# EasyEDA Pro project ProPrj_AD9363_Debug_2025-10-27.epro, board PCB1
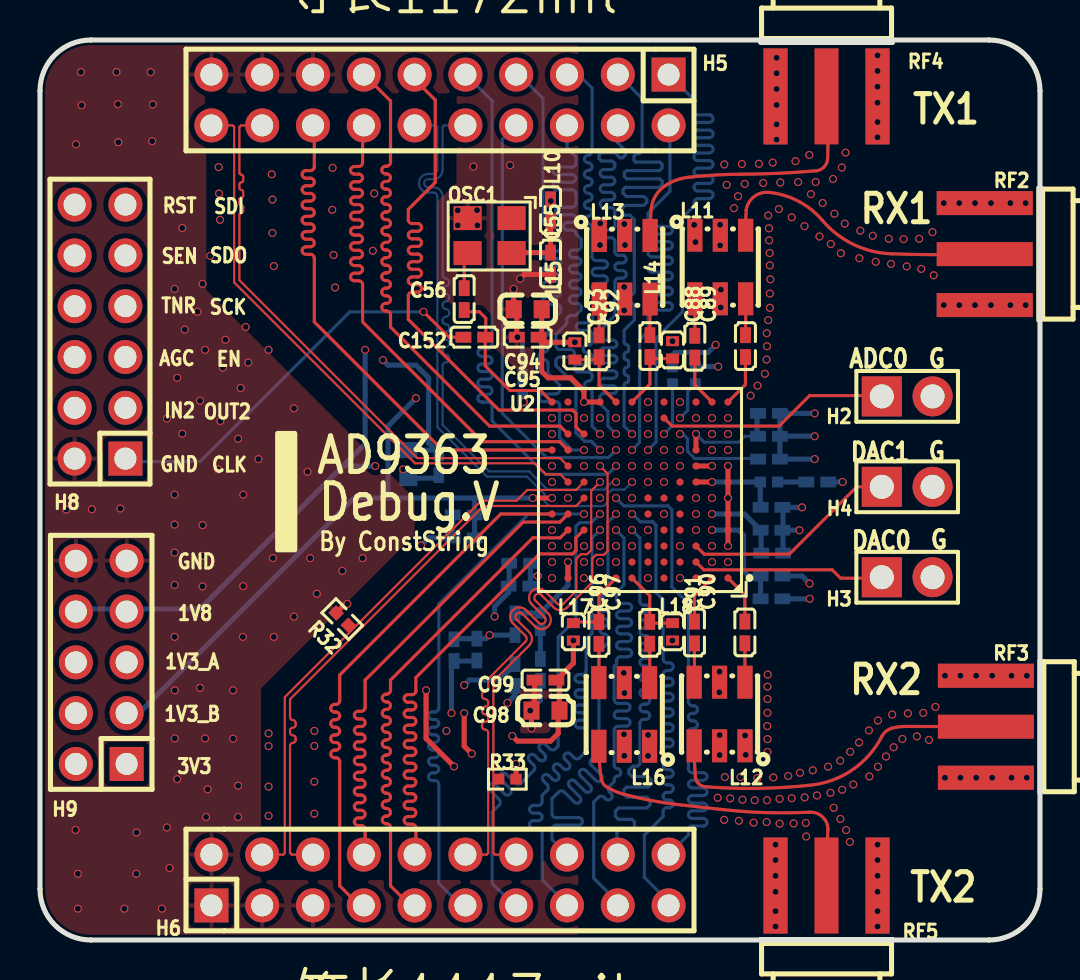
[diagram p3: board, top side]
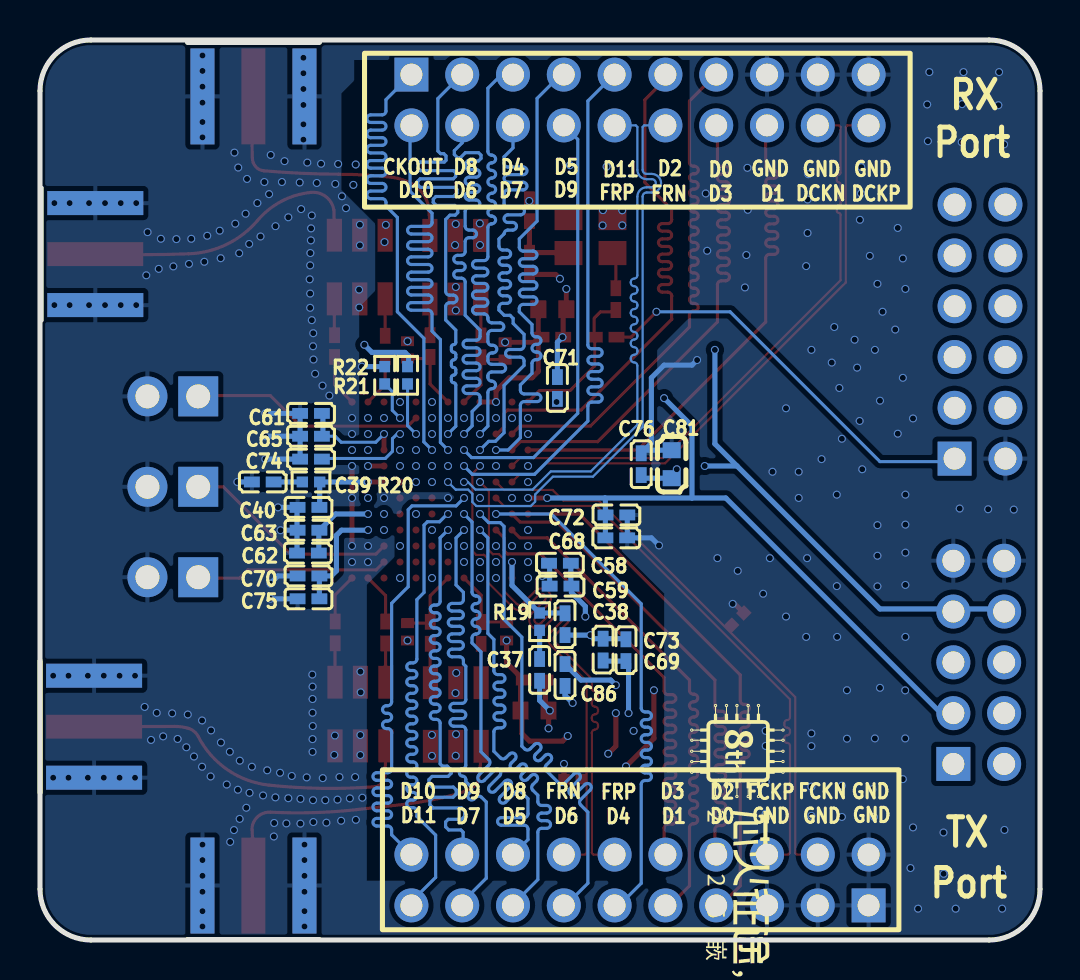
[diagram p4: board, bottom side, seen from below]

Outline 50 x 45 mm; copper layers: Top Layer, Inner1, Inner2, Bottom Layer. Coordinates in mm from the lower left corner of the outline.
Outline path: 0,42.46 0,2.54 arc(0.74,0.74) 2.54,0 47.46,0 arc(49.26,0.74) 50,2.54 50,42.46 arc(49.26,44.26) 47.46,45 2.54,45 arc(0.74,44.26) 0,42.46
Stack: Top Layer 0.035mm 外层铜厚1oz / Dielectric1 0.2104mm 7628 RC49% 8.6mil / Inner1 0.0152mm 内层铜厚 / Dielectric2 1.065mm 1.1mm H/HOZ Copper / Inner2 0.0152mm 内层铜厚 / Dielectric3 0.2104mm 7628 RC49% 8.6mil / Bottom Layer 0.035mm 外层铜厚1oz

## Design rules (mm)
net FB_CLK_N: DP3
net TX_FRAME_N: DP4
net RX_FRAME_N: DP2
net RX_FRAME_P: DP2
net TX_FRAME_P: DP4
net FB_CLK_P: DP3
net DATA_CLK_P: DP1
net DATA_CLK_N: DP1
template: 自定义配置
spacing copperThickness1oz (default): track to track 0.152, other pairs 0.102 to 0.3
spacing copperThickness2oz: track to track 0.203, other pairs 0.152 to 0.3
track width copperThickness1oz (default): min 0.127, default 0.254, max 2.54
track width copperThickness2oz: min 0.203, default 0.254, max 2.54
differential pair differentialPair (default): width min 0.102, default 0.109, max 2.54; gap min 0.152, default 0.152
via viaSize (default): diameter min 0.3, default 0.399, max 10; hole min 0.3, default 0.3, max 6.299

## Placement (name value [footprint] x y rotation side)
C37  1uF  [C0402]  25.02 13.5 90 bottom
C38  1nF  [C0402]  23.75 15.79 270 bottom
C39  1uF  [C0402]  38.86 22.9 180 bottom
C40  1nF  [C0402]  36.58 21.63 0 bottom
C55  100nF  [C0402]  25.53 33.82 270 top
C56  100nF  [C0402]  21.21 32.05 90 top
C58  1uF  [C0402]  24 18.84 0 bottom
C59  10nF  [C0402]  23.97 17.69 0 bottom
C61  1uF  [C0402]  36.45 26.33 180 bottom
C62  1uF  [C0402]  36.6 19.35 180 bottom
C63  10nF  [C0402]  36.58 20.49 180 bottom
C65  10nF  [C0402]  36.45 25.19 180 bottom
C68  1uF  [C0402]  21.19 20.11 0 bottom
C69  1uF  [C0402]  21.84 14.52 270 bottom
C70  1uF  [C0402]  36.58 18.2 180 bottom
C71  10nF  [C0402]  24.13 27.6 270 bottom
C72  10nF  [C0402]  21.18 21.25 0 bottom
C73  10nF  [C0402]  20.7 14.49 270 bottom
C74  10nF  [C0402]  36.45 24.05 180 bottom
C75  10nF  [C0402]  36.58 17.06 180 bottom
C76  10nF  [C0402]  19.94 23.79 270 bottom
C81  10uF  [C0603]  18.41 23.79 270 bottom
C86  1uF  [C0402]  23.75 13.25 270 bottom
C88  18pF  [C0402]  32.74 29.67 270 top
C89  18pF  [C0402]  35.27 29.7 270 top
C90  18pF  [C0402]  35.24 15.38 90 top
C91  18pF  [C0402]  32.72 15.38 90 top
C92  18pF  [C0402]  30.5 29.7 90 top
C93  18pF  [C0402]  27.95 29.69 90 top
C94  10uF  [C0603]  24.38 31.54 0 top
C95  1nF  [C0402]  24.38 30.14 0 top
C96  18pF  [C0402]  27.94 15.35 270 top
C97  18pF  [C0402]  30.49 15.36 270 top
C98  10uF  [C0603]  25.27 11.47 0 top
C99  1nF  [C0402]  25.27 13 0 top
C152  100nF  [C0402]  21.72 30.14 0 top
H2  PZ254V-11-02P  [HDR-TH_2P-P2.54-V-M]  43.36 27.18 0 top
H3  PZ254V-11-02P  [HDR-TH_2P-P2.54-V-M]  43.36 18.14 0 top
H4  PZ254V-11-02P  [HDR-TH_2P-P2.54-V-M]  43.36 22.66 0 top
H5  PZ254V-12-20P  [HDR-TH_20P-P2.54-V-M-R2-C10-S2.54]  20 42 180 top
H6  PZ254V-12-20P  [HDR-TH_20P-P2.54-V-M-R2-C10-S2.54]  20 3 0 top
H8  PZ254V-12-12P  [HDR-TH_12P-P2.54-V-M-R2-C6-S2.54]  3 30.42 90 top
H9  PZ254V-12-10P  [HDR-TH_10P-P2.54-V-M-R2-C5-S2.54]  3.06 13.88 90 top
L10  BLM15PD121SN1D  [L0402]  25.53 36.49 90 top
L11  TCM1-63AX+  [XFMR-SMD_TCM1-63AX]  34.01 33.65 0 top
L12  TCM1-63AX+  [XFMR-SMD_TCM1-63AX]  33.98 11.3 180 top
L13  TCM1-63AX+  [XFMR-SMD_TCM1-63AX]  29.23 33.64 0 top
L14  330nH  [IND-SMD_L1.0-W0.6]  31.62 29.51 270 top
L15  330nH  [IND-SMD_L1.0-W0.6]  26.74 29.45 270 top
L16  TCM1-63AX+  [XFMR-SMD_TCM1-63AX]  29.21 11.28 180 top
L17  330nH  [IND-SMD_L1.0-W0.6]  26.67 15.41 90 top
L18  330nH  [IND-SMD_L1.0-W0.6]  31.62 15.41 90 top
OSC1  40MHz  [OSC-SMD_4P-L3.2-W2.5-BL]  22.48 35.22 180 top
R19  1Ω  [R0402]  25.02 15.92 90 bottom
R20  1Ω  [R0402]  36.45 22.9 180 bottom
R21  10kΩ  [R0402]  31.62 28.24 90 bottom
R22  14.3kΩ  [R0402]  32.77 28.24 90 bottom
R32  NC  [R0402]  15.11 16.04 135 top
R33  NC  [R0402]  23.37 8.04 0 top
RF2  -  [SMA-SMD_BWSMA-KE-P001]  47.24 34.3 0 top
RF3  -  [SMA-SMD_BWSMA-KE-P001]  47.3 10.66 0 top
RF4  -  [SMA-SMD_BWSMA-KE-P001]  39.33 42.18 90 top
RF5  -  [SMA-SMD_BWSMA-KE-P001]  39.33 2.72 270 top
U2  AD9363ABCZ  [CSPBGA-144_L10.0-W10.0-R12-C12-P0.80-TL]  30 22.5 180 top

## Footprints (pads in the part's own frame, mm; a bottom-side part is the same pattern mirrored in y, then rotated)
C0402
  rect 0.79x0.54 smd: 1(-0.545,0) 2(0.545,0)
C0603
  rect 0.8x0.9 smd: 1(-0.7,0) 2(0.7,0)
CSPBGA-144_L10.0-W10.0-R12-C12-P0.80-TL
  round 0.36 smd: A1(-4.4,4.4) A2(-3.6,4.4) A3(-2.8,4.4) A4(-2,4.4) A5(-1.2,4.4) A6(-0.4,4.4) A7(0.4,4.4) A8(1.2,4.4) A9(2,4.4) A10(2.8,4.4) A11(3.6,4.4) A12(4.4,4.4) B1(-4.4,3.6) B2(-3.6,3.6) B3(-2.8,3.6) B4(-2,3.6) B5(-1.2,3.6) B6(-0.4,3.6) B7(0.4,3.6) B8(1.2,3.6) B9(2,3.6) B10(2.8,3.6) B11(3.6,3.6) B12(4.4,3.6) C1(-4.4,2.8) C2(-3.6,2.8) C3(-2.8,2.8) C4(-2,2.8) C5(-1.2,2.8) C6(-0.4,2.8) C7(0.4,2.8) C8(1.2,2.8) C9(2,2.8) C10(2.8,2.8) C11(3.6,2.8) C12(4.4,2.8) D1(-4.4,2) D2(-3.6,2) D3(-2.8,2) D4(-2,2) D5(-1.2,2) D6(-0.4,2) D7(0.4,2) D8(1.2,2) D9(2,2) D10(2.8,2) D11(3.6,2) D12(4.4,2) E1(-4.4,1.2) E2(-3.6,1.2) E3(-2.8,1.2) E4(-2,1.2) E5(-1.2,1.2) E6(-0.4,1.2) E7(0.4,1.2) E8(1.2,1.2) E9(2,1.2) E10(2.8,1.2) E11(3.6,1.2) E12(4.4,1.2) F1(-4.4,0.4) F2(-3.6,0.4) F3(-2.8,0.4) F4(-2,0.4) F5(-1.2,0.4) F6(-0.4,0.4) F7(0.4,0.4) F8(1.2,0.4) F9(2,0.4) F10(2.8,0.4) F11(3.6,0.4) F12(4.4,0.4) G1(-4.4,-0.4) G2(-3.6,-0.4) G3(-2.8,-0.4) G4(-2,-0.4) G5(-1.2,-0.4) G6(-0.4,-0.4) G7(0.4,-0.4) G8(1.2,-0.4) G9(2,-0.4) G10(2.8,-0.4) G11(3.6,-0.4) G12(4.4,-0.4) H1(-4.4,-1.2) H2(-3.6,-1.2) H3(-2.8,-1.2) H4(-2,-1.2) H5(-1.2,-1.2) H6(-0.4,-1.2) H7(0.4,-1.2) H8(1.2,-1.2) H9(2,-1.2) H10(2.8,-1.2) H11(3.6,-1.2) H12(4.4,-1.2) J1(-4.4,-2) J2(-3.6,-2) J3(-2.8,-2) J4(-2,-2) J5(-1.2,-2) J6(-0.4,-2) J7(0.4,-2) J8(1.2,-2) J9(2,-2) J10(2.8,-2) J11(3.6,-2) J12(4.4,-2) K1(-4.4,-2.8) K2(-3.6,-2.8) K3(-2.8,-2.8) K4(-2,-2.8) K5(-1.2,-2.8) K6(-0.4,-2.8) K7(0.4,-2.8) K8(1.2,-2.8) K9(2,-2.8) K10(2.8,-2.8) K11(3.6,-2.8) K12(4.4,-2.8) L1(-4.4,-3.6) L2(-3.6,-3.6) L3(-2.8,-3.6) L4(-2,-3.6) L5(-1.2,-3.6) L6(-0.4,-3.6) L7(0.4,-3.6) L8(1.2,-3.6) L9(2,-3.6) L10(2.8,-3.6) L11(3.6,-3.6) L12(4.4,-3.6) M1(-4.4,-4.4) M2(-3.6,-4.4) M3(-2.8,-4.4) M4(-2,-4.4) M5(-1.2,-4.4) M6(-0.4,-4.4) M7(0.4,-4.4) M8(1.2,-4.4) M9(2,-4.4) M10(2.8,-4.4) M11(3.6,-4.4) M12(4.4,-4.4)
HDR-TH_2P-P2.54-V-M
  rect 2x2 hole 1.2: 1(-1.27,0)
  round 2 hole 1.2: 2(1.27,0)
HDR-TH_10P-P2.54-V-M-R2-C5-S2.54
  rect 1.7x1.7 hole 1.1: 1(-5.08,-1.27)
  round 1.7 hole 1.1: 2(-5.08,1.27) 3(-2.54,-1.27) 4(-2.54,1.27) 5(0,-1.27) 6(0,1.27) 7(2.54,-1.27) 8(2.54,1.27) 9(5.08,-1.27) 10(5.08,1.27)
HDR-TH_12P-P2.54-V-M-R2-C6-S2.54
  rect 1.7x1.7 hole 1.1: 1(-6.35,-1.27)
  round 1.7 hole 1.1: 2(-6.35,1.27) 3(-3.81,-1.27) 4(-3.81,1.27) 5(-1.27,-1.27) 6(-1.27,1.27) 7(1.27,-1.27) 8(1.27,1.27) 9(3.81,-1.27) 10(3.81,1.27) 11(6.35,-1.27) 12(6.35,1.27)
HDR-TH_20P-P2.54-V-M-R2-C10-S2.54
  rect 1.7x1.7 hole 1.1: 1(-11.43,-1.27)
  round 1.7 hole 1.1: 2(-11.43,1.27) 3(-8.89,-1.27) 4(-8.89,1.27) 5(-6.35,-1.27) 6(-6.35,1.27) 7(-3.81,-1.27) 8(-3.81,1.27) 9(-1.27,-1.27) 10(-1.27,1.27) 11(1.27,-1.27) 12(1.27,1.27) 13(3.81,-1.27) 14(3.81,1.27) 15(6.35,-1.27) 16(6.35,1.27) 17(8.89,-1.27) 18(8.89,1.27) 19(11.43,-1.27) 20(11.43,1.27)
IND-SMD_L1.0-W0.6
  rect 0.5x0.648 smd: 1(-0.434,0) 2(0.434,0)
L0402
  rect 0.79x0.54 smd: 1(-0.545,0) 2(0.545,0)
OSC-SMD_4P-L3.2-W2.5-BL
  rect 1.4x1.2 smd: 1(-1.1,-0.875) 2(1.1,-0.875) 3(1.1,0.875) 4(-1.1,0.875)
R0402
  rect 0.566x0.54 smd: 1(-0.433,0) 2(0.433,0)
SMA-SMD_BWSMA-KE-P001
  rect 4.8x1.2 smd: 1(0,-2.55) 2(0,2.55) 5(0,0)
  rect 4.8x1.2 smd far side: 3(0,2.55) 4(0,-2.55)
XFMR-SMD_TCM1-63AX
  rect 0.76x1.65 smd: 1(-1.27,1.59) 2(0,1.59) 3(1.27,1.59) 4(1.27,-1.59) 5(0,-1.59) 6(-1.27,-1.59)

## Nets
As in the schematic.

Pads without a net: OSC1 1; U2 A3 A5 M3 M5 M11

## Via types
v1: diameter 0.399, hole 0.299, Top Layer to Bottom Layer, 420 vias

## Routing (per net, layer and track width the routed paths; a pad name or vN(x,y) marks a point on that pad's centre or on a via; arc(x,y) is an arc through that point)
1V3_A: length 78.8
  Top Layer w0.254: U2.J3 v1(32.8,25.3) ; v1(20.7,8.68) 19.3,10.08 v1(19.3,12.49)
  Inner2 w0.254: 19.26,13.89 H9.5 1.79,13.89 H9.6 ; 19.26,13.89 19.3,13.84 v1(19.3,12.49) ; 19.26,13.89 22.19,13.89 25.55,17.25 ; v1(32.8,25.3) 33.15,24.95 33.15,22.52 33.57,22.1 v1(33.6,22.1) v1(33.6,21.3) 35.26,21.3 36.83,19.73 36.83,14.9 35.94,14.01 27.81,14.01 26.54,12.74 26.54,10.96 24.89,9.31 22.61,9.31 21.97,8.68 v1(20.7,8.68) ; 25.55,17.25 v1(27.2,18.9) v1(28,18.9) ; 25.55,17.25 24.89,17.91 v1(24.89,18.2)
  Bottom Layer w0.152: C65.2 35.24,25.19 34.94,24.89 33.21,24.89 v1(32.8,25.3)
  Bottom Layer w0.254: 24.52,17.69 24.52,18.26 ; 24.52,18.26 24.52,18.81 C58.2 ; 24.52,18.26 24.58,18.2 v1(24.89,18.2) ; C62.2 36.06,20.46 C63.2 35.22,21.3 v1(33.6,21.3) ; 35.85,26.16 35.85,25.19
1V3_B: length 145.3
  Top Layer w0.254: v1(21.59,9.31) 21.21,9.69 v1(21.21,11.34) ; U2.M9 v1(27.2,26.9) 27.2,27.45 26.54,28.11 25.4,28.11 25.08,28.42 25.08,29.99 ; 25.08,29.99 C95.2 ; 25.08,29.99 C94.2 ; 25.08,29.99 25.18,29.89 v1(26.74,29.89) ; v1(25.6,22.1) v1(24.64,22.1) ; v1(23.61,10.2) 23.87,9.95 25.53,9.95 25.91,10.33 25.91,11.41 C98.2 25.97,12.84 C99.2 26.67,13.85 v1(26.67,14.97)
  Inner2 w0.254: 1.79,11.34 1.79,11.34 v1(20.57,11.34) v1(21.21,11.34) 27.2,17.34 v1(27.2,18.1) v1(28,18.1) ; 23.61,9.95 22.22,9.95 v1(21.59,9.31) ; 23.61,9.95 v1(23.61,10.2) ; 23.61,9.95 24.64,9.95 25.91,11.22 25.91,12.87 27.56,14.52 35.69,14.52 36.19,15.03 36.19,19.22 34.91,20.5 v1(33.6,20.5) v1(32.8,20.5) v1(32.8,21.3) 32,22.1 32,22.52 32.64,23.16 32.64,24.66 v1(32,25.3) ; v1(26.74,29.89) 31.57,29.89 v1(31.62,29.94) ; v1(18.8,27.09) 18.99,26.9 v1(24.17,26.9) v1(27.2,26.9) ; v1(26.67,14.97) v1(31.62,14.97)
  Bottom Layer w0.152: C74.2 35.87,24.08 32.73,24.08 32.38,24.43 32.38,25.07 32.15,25.3 v1(32,25.3)
  Bottom Layer w0.254: v1(20.57,11.34) 20.57,13.82 C73.2 21.81,13.95 C69.2 ; 4.95,11.34 15.71,22.1 17.4,22.1 ; 21.75,22.1 21.73,22.08 C68.2 ; 21.75,22.1 17.4,22.1 ; 21.75,22.1 v1(24.64,22.1) ; 17.4,22.1 17.4,25.7 v1(18.8,27.09) ; v1(33.6,20.5) 33.61,20.49 34.93,20.49 35.18,20.23 35.18,18.46 35.43,18.2 C70.2 C75.2
1V8: length 63.7
  Inner2 w0.254: 25.52,29 25.54,29.02 v1(25.54,36.95) ; 25.52,29 33.02,29 v1(33.78,29.76) ; 25.52,29 23.5,29 22.99,29.51 v1(16.26,29.51) ; v1(16.76,23.7) v1(25.6,23.7)
  Bottom Layer w0.254: 15.15,23.7 8,16.55 1.92,16.55 H9.8 ; 15.15,23.7 16.26,24.81 v1(16.26,29.51) ; 15.15,23.7 v1(16.76,23.7) ; 31.62,28.67 31.57,28.72 31.57,29.2 31.75,29.38 33.4,29.38 v1(33.78,29.76) ; C81.2 19.78,23.09 C76.2
  vias: v1(18.16,23.54)
3V3: length 33.2
  Inner2 w0.254: 23.11,12.11 23.11,12.11 v1(23.37,11.85) ; 23.11,12.11 28.8,17.8 v1(28.8,18.9) ; 23.11,12.11 19.8,8.81 H9.1 1.79,8.81 H9.2
  Bottom Layer w0.254: C86.2 23.75,12.23 v1(23.37,11.85)
GND: length 53.1
  Top Layer w0.254: C99.1 24.73,11.63 C98.1 v1(24.57,10.58) ; R33.2 v1(23.8,8.81) ; v1(34.4,19.7) U2.D1 U2.E1 v1(34.4,22.1) U2.G1 v1(34.4,23.7) ; v1(15.37,16.81) 15.26,16.81 14.81,16.35 ; U2.H3 v1(33.6,23.7) ; v1(23.88,30.14) C95.1 23.84,31.38 C94.1 v1(23.68,32.55) ; v1(24,33.06) 24.22,33.28 C55.2
  Bottom Layer w0.254: v1(17.15,29) 17.4,28.74 18.8,28.74 19.43,28.11 19.43,24.84 19.78,24.49 ; C65.1 v1(38.74,25.19) ; C65.1 C61.1 v1(38.74,26.33) ; C65.1 C74.1 v1(38.74,24.05) ; C75.1 v1(38.48,17.06) ; v1(19.05,19.73) 19.43,20.11 C68.1 20.63,20.11 C72.1 ; 19.78,24.49 C76.1 ; 19.78,24.49 C81.1 ; 37.15,20.49 v1(37.97,20.49) ; 37.15,20.49 37.15,21.6 C40.2 v1(38.1,21.63) ; 37.15,20.49 C63.1 ; 37.15,20.49 C62.1 ; v1(24.51,11.47) 25.02,11.98 C37.1 ; v1(23.88,30.14) 24.13,29.89 C71.1 ; v1(38.48,17.82) 38.1,18.2 C70.1 ; C38.2 v1(22.48,15.25) 22.3,15.06 C69.1 20.73,15.06 C73.1 ; 39.41,22.9 v1(40.13,22.9) ; C58.1 23.46,17.72 C59.1 23.43,17.38 22.73,16.68 v1(22.73,16.17) ; C86.1 22.95,13 21.46,13 v1(21.21,12.74) ; 32.77,28.67 v1(33.91,28.67)
  vias: v1(1.31,21.52) v1(1.8,39.78) v1(1.78,5.5) v1(1.89,3.31) v1(1.89,1.57) v1(2.05,43.4) v1(2.08,41.74) v1(2.59,21.54) v1(3.83,43.4) v1(3.9,41.79) v1(3.91,39.89) v1(4.02,21.57) v1(4.22,1.57) v1(4.83,5.38) v1(4.82,3.31) v1(5.53,43.4) v1(5.64,41.78) v1(5.61,39.94) v1(6.1,1.57) v1(6.35,26.08) v1(6.35,5.63) v1(6.48,3.6) v1(6.73,32.55) v1(6.73,22.27) v1(6.73,20.77) v1(6.73,19.37) v1(6.73,17.75) v1(6.73,15.16) v1(6.74,12.48) v1(6.74,10.08) v1(6.86,34.08) v1(6.86,28.11) v1(6.86,8.04) v1(7.11,35.6) v1(7.11,25.31) v1(7.24,30.52) v1(7.87,31.41) v1(8,26.97) v1(8,12.61) v1(8.13,32.81) v1(8.13,20.74) v1(8.13,19.21) v1(8.13,17.68) v1(8.25,29.51) v1(8.25,10.08) v1(8.3,6.15) v1(8.38,7.53) v1(8.51,34.2) v1(8.93,38.64) v1(8.89,23.54) v1(8.95,37.33) v1(9,36.01) v1(9.02,25.95) v1(9.14,28.62) v1(9.27,30.01) v1(9.65,12.49) v1(9.65,10.06) v1(9.91,25.06) v1(9.91,7.72) v1(9.91,6.15) v1(10.03,27.6) v1(10.14,15.16) v1(10.16,22.27) v1(10.16,17.69) v1(10.29,30.65) v1(10.41,28.87) v1(10.92,24.05) v1(11.43,29.51) v1(11.43,10.33) v1(11.43,9.69) v1(11.43,7.67) v1(11.43,6.21) v1(11.59,38.29) v1(11.62,37.02) v1(11.62,35.35) v1(11.64,19.09) v1(11.69,33.7) v1(11.69,15.16) v1(12.06,23.41) v1(12.06,22.1) v1(12.7,26.58) v1(12.7,16.17) v1(13.38,23.41) v1(13.51,19.09) v1(13.72,10.46) v1(13.72,9.7) v1(13.72,7.92) v1(13.72,6.32) v1(13.84,17.31) v1(14.63,38.61) v1(14.61,36.51) v1(14.68,34.25) v1(14.75,32.63) v1(15.11,18.46) v1(16.13,19.09) v1(16.64,34.46) v1(16.71,37.33) v1(20.32,10.46) v1(20.89,36.48) v1(20.89,35.73) v1(21.67,38.67) v1(21.85,36.49) v1(21.87,35.73) v1(23.5,38.74) v1(25.6,26.1) v1(25.6,25.3) v1(25.6,22.9) v1(25.6,20.5) v1(25.6,19.7) v1(25.6,18.9) v1(25.6,18.1) v1(26.4,26.1) v1(26.4,22.1) v1(26.4,19.7) v1(27.2,26.1) v1(27.2,23.7) v1(27.2,19.7) v1(28.01,35.83) v1(28,34.75) v1(28,26.1) v1(28,22.1) v1(28,19.7) v1(28.8,26.1) v1(28.8,19.7) v1(29.22,35.8) v1(29.25,34.75) v1(29.21,32.65) v1(29.21,31.48) v1(29.19,13.35) v1(29.22,12.35) v1(29.2,10.29) v1(29.22,9.21) v1(29.6,26.1) v1(29.6,23.7) v1(29.6,22.1) v1(29.6,19.7) v1(30.4,26.9) v1(30.4,23.7) v1(30.4,18.1) v1(30.4,10.25) v1(30.4,9.21) v1(31.2,23.7) v1(32,26.9) v1(32,19.7) v1(32,18.1) v1(32.71,35.76) v1(32.77,34.9) v1(32.8,26.1) v1(32.8,22.1) v1(33.6,26.1) v1(33.6,25.3) v1(33.6,24.5) v1(33.6,19.7) v1(33.6,18.9) v1(33.88,7.11) v1(34,35.76) v1(34,34.73) v1(34.05,32.52) v1(34.04,31.63) v1(33.98,13.42) v1(33.97,12.38) v1(33.98,10.25) v1(33.98,9.25) v1(34.21,38.78) v1(34.24,8.15) v1(34.21,6.01) v1(34.33,37.76) v1(34.4,26.1) v1(34.4,25.3) v1(34.4,24.5) v1(34.4,18.9) v1(34.51,7.08) v1(34.7,36.59) v1(34.9,37.19) v1(34.94,5.96) v1(35.03,8.15) v1(35.09,38.8) v1(35.12,7.02) v1(35.24,37.8) v1(35.25,10.22) v1(35.29,9.26) v1(35.53,27.22) v1(35.74,6.99) v1(35.68,5.87) v1(35.95,38.81) v1(35.88,27.72) v1(35.86,8.09) v1(36.16,37.85) v1(36.24,28.31) v1(36.34,30.34) v1(36.33,29.02) v1(36.33,5.9) v1(36.41,36.23) v1(36.45,35.58) v1(36.41,30.99) v1(36.35,29.69) v1(36.39,13.27) v1(36.37,12.67) v1(36.37,12.05) v1(36.37,11.36) v1(36.36,10.7) v1(36.37,10.04) v1(36.37,9.4) v1(36.35,6.99) v1(36.46,34.98) v1(36.48,34.35) v1(36.49,33.73) v1(36.52,33.03) v1(36.49,32.32) v1(36.49,31.61) v1(36.64,38.87) v1(36.66,8.13) v1(36.83,44.11) v1(36.83,43.34) v1(36.83,42.55) v1(36.83,41.75) v1(36.83,40.78) v1(36.83,40.02) v1(36.78,4.77) v1(36.78,4) v1(36.78,3.21) v1(36.78,2.41) v1(36.78,1.44) v1(36.78,0.68) v1(36.94,36.55) v1(37.01,37.88) v1(36.98,7.05) v1(36.98,5.82) v1(37.41,8.2) v1(37.58,36.14) v1(37.58,7.09) v1(37.68,5.83) v1(37.77,38.94) v1(37.91,37.9) v1(38,8.36) v1(38.23,35.69) v1(38.23,7.13) v1(38.29,5.85) v1(38.31,5.17) v1(38.46,39.25) v1(38.55,37.29) v1(38.64,8.49) v1(38.78,37.9) v1(38.85,7.23) v1(38.97,35.17) v1(39.13,36.85) v1(39.41,8.66) v1(39.54,34.8) v1(39.52,7.36) v1(39.65,38.05) v1(39.72,36.31) v1(39.69,6.61) v1(40.04,34.34) v1(40.01,8.97) v1(40.02,6.05) v1(40.09,38.62) v1(40.11,7.51) v1(40.24,35.82) v1(40.28,39.37) v1(40.3,5.5) v1(40.51,9.41) v1(40.49,4.9) v1(40.66,7.77) v1(41.01,35.46) v1(40.97,34.09) v1(40.95,9.87) v1(41.45,10.48) v1(41.47,8.18) v1(41.64,35.21) v1(41.78,33.91) v1(41.88,44.23) v1(41.88,43.45) v1(41.88,42.67) v1(41.88,41.87) v1(41.88,40.9) v1(41.88,40.13) v1(41.9,10.98) v1(41.9,8.66) v1(41.88,4.77) v1(41.88,4) v1(41.88,3.21) v1(41.88,2.41) v1(41.88,1.44) v1(41.88,0.68) v1(42.3,9.17) v1(42.44,35.06) v1(42.55,33.8) v1(42.61,11.27) v1(42.68,9.64) v1(43.12,10.05) v1(43.18,35.04) v1(43.33,33.68) v1(43.39,11.33) v1(43.84,10.18) v1(43.96,35.06) v1(44.06,33.56) v1(44.16,11.36) v1(44.45,10) v1(44.62,35.39) v1(44.69,33.23) v1(44.77,11.65) v1(45.19,36.85) v1(45.19,31.75) v1(45.25,13.21) v1(45.25,8.11) v1(45.96,36.85) v1(45.96,31.75) v1(46.02,13.21) v1(46.02,8.11) v1(46.75,36.85) v1(46.75,31.75) v1(46.81,13.21) v1(46.81,8.11) v1(47.55,36.85) v1(47.55,31.75) v1(47.61,13.21) v1(47.61,8.11) v1(48.52,36.85) v1(48.52,31.75) v1(48.58,13.21) v1(48.58,8.11) v1(49.28,36.85) v1(49.28,31.75) v1(49.34,13.21) v1(49.34,8.11)
AUX_ADC: length 11.7
  Top Layer w0.152: U2.L5 31.6,25.7 36.96,25.7 38.48,27.22 42.05,27.22 H2.1
AUX_DAC1: length 9.6
  Top Layer w0.152: H3.1 42.04,18.09 40.03,18.09 39.61,18.51 33.19,18.51 U2.B3
AUX_DAC2: length 10.9
  Top Layer w0.152: H4.1 40.84,22.66 37.47,19.29 33.21,19.29 U2.C3
CLK_OUT: length 29.8
  Bottom Layer w0.158: H5.1 31.45,43.27 32.7,42.02 32.7,41.45 arc(32.76,41.31) 32.89,41.26 33.46,41.26 arc(33.66,41.07) 33.46,40.88 32.89,40.88 arc(32.7,40.69) 32.89,40.5 33.46,40.5 arc(33.66,40.31) 33.46,40.11 32.89,40.11 arc(32.7,39.92) 32.89,39.73 33.46,39.73 arc(33.66,39.54) 33.46,39.35 32.89,39.35 arc(32.7,39.16) 32.89,38.97 33.46,38.97 arc(33.66,38.78) 33.46,38.59 32.89,38.59 arc(32.7,38.4) 32.89,38.21 33.46,38.21 arc(33.66,38.02) 33.46,37.83 32.89,37.83 arc(32.7,37.64) 32.89,37.45 33.46,37.45 arc(33.66,37.26) 33.46,37.07 32.89,37.07 arc(32.76,37.01) 32.7,36.88 32.7,36.7 32.13,36.13 32.13,31.41 30.81,30.09 30.81,24.91 v1(30.4,24.5)
CTRL_IN2: length 31.8
  Inner2 w0.158: H8.4 1.73,26.59 3.01,25.31 5.5,25.31 10.56,20.25 20.84,20.25 20.96,20.36 20.96,20.38 21.47,20.9 30,20.9 v1(30.4,20.5)
CTRL_OUT2: length 29.8
  Inner2 w0.158: v1(31.2,21.3) 30.8,21.7 20.51,21.7 19.69,20.87 10.87,20.87 5.14,26.61 H8.3
DATA_CLK_N: length 29.8
  Top Layer w0.109: H5.18 10.05,40.73 9.97,40.65 9.97,38.36 arc(10,38.29) 10.07,38.26 arc(10.13,38.24) 10.16,38.17 10.16,37.98 arc(10.13,37.91) 10.07,37.88 arc(10,37.85) 9.97,37.79 9.97,37.6 arc(10,37.53) 10.07,37.5 arc(10.13,37.47) 10.16,37.41 10.16,37.22 arc(10.13,37.15) 10.07,37.12 arc(10,37.09) 9.97,37.03 9.97,36.83 arc(10,36.77) 10.07,36.74 arc(10.13,36.71) 10.16,36.64 10.16,36.45 arc(10.13,36.39) 10.07,36.36 arc(10,36.33) 9.97,36.26 9.97,32.99 18.86,24.1 26,24.1 U2.H11
DATA_CLK_P: length 29.8
  Top Layer w0.109: U2.G11 26.02,23.28 25.29,23.28 24.74,23.83 18.75,23.83 9.71,32.88 9.71,40.65 9.63,40.73 H5.20
EN_AGC: length 33.1
  Inner2 w0.158: H8.6 1.75,29.15 3.05,27.86 5.21,27.86 11.43,21.63 18.8,21.63 19.69,22.52 30.82,22.52 v1(31.2,22.9)
ENABLE: length 29.3
  Inner2 w0.158: v1(30.4,22.9) 30.02,23.28 18.76,23.28 18,22.52 11.68,22.52 5.06,29.15 H8.5
EX_CLK: length 20.6
  Top Layer w0.152: v1(19.18,31.41) 20.45,30.14 C152.1
  Bottom Layer w0.152: v1(19.18,31.41) 15.49,31.41 8,23.92 4.42,23.92 H8.1
FB_CLK_N: length 28.4
  Top Layer w0.109: H6.4 12.16,4.27 12.24,4.35 12.24,12.14 22.06,21.96 23.83,21.96 24.37,22.5 26.8,22.5 U2.G10
FB_CLK_P: length 28.4
  Top Layer w0.109: U2.F10 26.8,21.7 22.17,21.7 12.5,12.04 12.5,11.14 arc(12.54,11.04) 12.64,11 arc(12.74,10.96) 12.78,10.86 12.78,10.76 arc(12.74,10.66) 12.64,10.62 arc(12.54,10.58) 12.5,10.48 12.5,10.38 arc(12.54,10.28) 12.64,10.24 arc(12.74,10.19) 12.78,10.1 12.78,9.99 arc(12.74,9.9) 12.64,9.85 arc(12.54,9.81) 12.5,9.72 12.5,4.36 12.59,4.27 H6.6
P0_TX_D0: length 28.4
  Top Layer w0.158: H6.7 15.97,1.73 14.99,2.71 14.99,8.92 arc(14.93,9.06) 14.8,9.11 14.73,9.11 arc(14.54,9.3) 14.73,9.49 14.8,9.49 arc(14.99,9.68) 14.8,9.87 14.73,9.87 arc(14.54,10.06) 14.73,10.25 14.8,10.25 arc(14.99,10.45) 14.8,10.64 14.73,10.64 arc(14.54,10.83) 14.73,11.02 14.8,11.02 arc(14.99,11.21) 14.8,11.4 14.73,11.4 arc(14.54,11.59) 14.73,11.78 14.8,11.78 arc(14.93,11.83) 14.99,11.97 14.99,13.25 23.04,21.3 U2.E12
P0_TX_D1: length 28.4
  Top Layer w0.158: H6.9 18.5,1.73 17.53,2.71 17.53,5.62 arc(17.47,5.76) 17.34,5.81 17.3,5.81 arc(17.11,6.01) 17.3,6.2 17.34,6.2 arc(17.53,6.39) 17.34,6.58 17.3,6.58 arc(17.11,6.77) 17.3,6.96 17.34,6.96 arc(17.53,7.15) 17.34,7.34 17.3,7.34 arc(17.11,7.53) 17.3,7.72 17.34,7.72 arc(17.53,7.91) 17.34,8.1 17.3,8.1 arc(17.11,8.29) 17.3,8.48 17.34,8.48 arc(17.53,8.67) 17.34,8.86 17.3,8.86 arc(17.11,9.05) 17.3,9.24 17.34,9.24 arc(17.53,9.43) 17.34,9.62 17.3,9.62 arc(17.11,9.82) 17.3,10.01 17.34,10.01 arc(17.53,10.2) 17.34,10.39 17.3,10.39 arc(17.11,10.58) 17.3,10.77 17.34,10.77 arc(17.53,10.96) 17.34,11.15 17.3,11.15 arc(17.11,11.34) 17.3,11.53 17.34,11.53 arc(17.53,11.72) 17.34,11.91 17.3,11.91 arc(17.11,12.1) 17.3,12.29 17.34,12.29 arc(17.47,12.35) 17.53,12.48 17.53,13 24.64,20.11 26.01,20.11 U2.D11
P0_TX_D2: length 28.3
  Top Layer w0.158: U2.E11 26,20.9 24.16,20.9 16.26,13 16.26,11.63 arc(16.2,11.49) 16.07,11.44 15.91,11.44 arc(15.72,11.25) 15.91,11.06 16.07,11.06 arc(16.26,10.86) 16.07,10.67 15.91,10.67 arc(15.72,10.48) 15.91,10.29 16.07,10.29 arc(16.26,10.1) 16.07,9.91 15.91,9.91 arc(15.72,9.72) 15.91,9.53 16.07,9.53 arc(16.26,9.34) 16.07,9.15 15.91,9.15 arc(15.72,8.96) 15.91,8.77 16.07,8.77 arc(16.26,8.58) 16.07,8.39 15.91,8.39 arc(15.72,8.2) 15.91,8.01 16.07,8.01 arc(16.26,7.82) 16.07,7.63 15.91,7.63 arc(15.72,7.44) 15.91,7.25 16.07,7.25 arc(16.26,7.06) 16.07,6.86 15.91,6.86 arc(15.72,6.67) 15.91,6.48 16.07,6.48 arc(16.26,6.29) 16.07,6.1 15.91,6.1 arc(15.72,5.91) 15.91,5.72 16.07,5.72 arc(16.2,5.67) 16.26,5.53 16.26,4.34 H6.8
P0_TX_D3: length 28.4
  Top Layer w0.158: U2.D10 27.19,20.5 26.8,20.11 26.8,19.47 26.63,19.3 24.98,19.3 18.8,13.12 18.8,12.46 arc(18.74,12.32) 18.61,12.27 18.4,12.27 arc(18.21,12.08) 18.4,11.89 18.61,11.89 arc(18.8,11.7) 18.61,11.51 18.4,11.51 arc(18.21,11.32) 18.4,11.13 18.61,11.13 arc(18.8,10.94) 18.61,10.75 18.4,10.75 arc(18.21,10.55) 18.4,10.36 18.61,10.36 arc(18.8,10.17) 18.61,9.98 18.4,9.98 arc(18.21,9.79) 18.4,9.6 18.61,9.6 arc(18.8,9.41) 18.61,9.22 18.4,9.22 arc(18.21,9.03) 18.4,8.84 18.61,8.84 arc(18.8,8.65) 18.61,8.46 18.4,8.46 arc(18.21,8.27) 18.4,8.08 18.61,8.08 arc(18.8,7.89) 18.61,7.7 18.4,7.7 arc(18.21,7.51) 18.4,7.32 18.61,7.32 arc(18.8,7.13) 18.61,6.94 18.4,6.94 arc(18.21,6.74) 18.4,6.55 18.61,6.55 arc(18.8,6.36) 18.61,6.17 18.4,6.17 arc(18.21,5.98) 18.4,5.79 18.61,5.79 arc(18.74,5.74) 18.8,5.6 18.8,4.34 H6.10
P0_TX_D4: length 28.4
  Bottom Layer w0.158: v1(27.2,21.3) 24.43,21.3 19.94,16.81 19.94,11.59 arc(19.88,11.46) 19.75,11.4 19.62,11.4 arc(19.43,11.21) 19.62,11.02 19.75,11.02 arc(19.94,10.83) 19.75,10.64 19.62,10.64 arc(19.43,10.45) 19.62,10.26 19.75,10.26 arc(19.94,10.07) 19.75,9.88 19.62,9.88 arc(19.43,9.69) 19.62,9.5 19.75,9.5 arc(19.94,9.31) 19.75,9.12 19.62,9.12 arc(19.43,8.93) 19.62,8.74 19.75,8.74 arc(19.94,8.55) 19.75,8.36 19.62,8.36 arc(19.43,8.17) 19.62,7.97 19.75,7.97 arc(19.88,7.92) 19.94,7.78 19.94,2.84 21.04,1.73 H6.11
P0_TX_D5: length 28.4
  Bottom Layer w0.158: H6.15 26.35,1.78 25.11,3.02 25.11,5.39 arc(25.05,5.53) 24.92,5.58 24.66,5.58 arc(24.47,5.77) 24.66,5.97 24.92,5.97 arc(25.11,6.16) 24.92,6.35 24.66,6.35 arc(24.47,6.54) 24.66,6.73 24.92,6.73 arc(25.05,6.78) 25.11,6.92 25.11,7.24 25.36,7.49 arc(25.42,7.63) 25.36,7.76 25.18,7.95 arc(25.18,8.22) 25.45,8.22 25.63,8.03 arc(25.9,8.03) 25.9,8.3 25.72,8.49 arc(25.72,8.76) 25.99,8.76 26.17,8.57 arc(26.44,8.57) 26.44,8.84 26.26,9.03 arc(26.26,9.3) 26.53,9.3 26.71,9.11 arc(26.85,9.05) 26.98,9.11 27.31,9.43 27.31,10.41 arc(27.25,10.55) 27.11,10.6 26.94,10.6 arc(26.75,10.79) 26.94,10.98 27.11,10.98 arc(27.31,11.18) 27.11,11.37 26.94,11.37 arc(26.75,11.56) 26.94,11.75 27.11,11.75 arc(27.31,11.94) 27.11,12.13 26.94,12.13 arc(26.75,12.32) 26.94,12.51 27.11,12.51 arc(27.31,12.7) 27.11,12.89 26.94,12.89 arc(26.75,13.08) 26.94,13.27 27.11,13.27 arc(27.25,13.33) 27.31,13.46 27.31,15.03 27.61,15.33 27.61,20.11 v1(28,20.5)
P0_TX_D6: length 28.4
  Bottom Layer w0.158: v1(28,21.3) 27.57,20.87 26.99,20.87 26.8,20.68 26.8,16.03 25.91,15.14 25.91,9.69 25.77,9.55 arc(25.63,9.5) 25.5,9.55 25.28,9.77 arc(25.01,9.77) 25.01,9.5 25.23,9.28 arc(25.23,9.01) 24.96,9.01 24.74,9.23 arc(24.47,9.23) 24.47,8.96 24.69,8.74 arc(24.74,8.61) 24.69,8.47 24.05,7.83 arc(23.91,7.78) 23.78,7.83 23.3,8.31 arc(23.03,8.31) 23.03,8.04 23.51,7.56 arc(23.51,7.29) 23.24,7.29 22.76,7.77 arc(22.49,7.77) 22.49,7.5 22.97,7.02 arc(23.02,6.89) 22.97,6.75 22.61,6.39 22.61,2.84 23.71,1.73 H6.13
P0_TX_D7: length 28.4
  Bottom Layer w0.158: v1(28.8,20.5) 29.2,20.1 29.2,17.75 28.83,17.39 28.83,17.02 arc(28.88,16.88) 29.02,16.83 29.4,16.83 arc(29.59,16.64) 29.4,16.45 29.02,16.45 arc(28.83,16.26) 29.02,16.07 29.4,16.07 arc(29.59,15.88) 29.4,15.69 29.02,15.69 arc(28.83,15.5) 29.02,15.3 29.4,15.3 arc(29.59,15.11) 29.4,14.92 29.02,14.92 arc(28.83,14.73) 29.02,14.54 29.4,14.54 arc(29.59,14.35) 29.4,14.16 29.02,14.16 arc(28.88,14.11) 28.83,13.97 28.83,13.8 28.71,13.68 28.71,12.02 arc(28.77,11.89) 28.9,11.83 29.31,11.83 arc(29.5,11.64) 29.31,11.45 28.9,11.45 arc(28.71,11.26) 28.9,11.07 29.31,11.07 arc(29.5,10.88) 29.31,10.69 28.9,10.69 arc(28.77,10.63) 28.71,10.5 28.71,8.73 arc(28.76,8.62) 28.87,8.57 arc(28.98,8.53) 29.03,8.41 29.03,8.35 arc(28.98,8.24) 28.87,8.19 arc(28.76,8.14) 28.71,8.03 28.71,7.92 28.47,7.68 arc(28.41,7.55) 28.47,7.41 28.55,7.33 arc(28.55,7.06) 28.28,7.06 28.2,7.14 arc(28.06,7.2) 27.93,7.14 27.69,6.9 27.69,3.09 28.89,1.89 H6.17
P0_TX_D8: length 28.4
  Bottom Layer w0.158: H6.16 25.6,5.02 25.6,5.55 arc(25.66,5.68) 25.79,5.74 26.93,5.74 arc(27.12,5.93) 26.93,6.12 25.79,6.12 arc(25.66,6.18) 25.6,6.31 25.6,7.06 25.94,7.4 arc(26.07,7.46) 26.21,7.4 26.71,6.9 arc(26.98,6.9) 26.98,7.17 26.48,7.67 arc(26.48,7.94) 26.75,7.94 27.25,7.44 arc(27.52,7.44) 27.52,7.71 27.02,8.21 arc(27.02,8.48) 27.29,8.48 27.79,7.98 arc(28.06,7.98) 28.06,8.25 27.56,8.75 arc(27.5,8.88) 27.56,9.02 27.95,9.42 27.95,14.41 28.4,14.85 28.4,15.11 arc(28.34,15.24) 28.21,15.3 28.19,15.3 arc(28,15.49) 28.19,15.68 28.21,15.68 arc(28.4,15.87) 28.21,16.06 28.19,16.06 arc(28,16.25) 28.19,16.44 28.21,16.44 arc(28.4,16.63) 28.21,16.82 28.19,16.82 arc(28,17.01) 28.19,17.2 28.21,17.2 arc(28.34,17.26) 28.4,17.39 28.4,20.9 v1(28.8,21.3)
P0_TX_D9: length 28.4
  Bottom Layer w0.158: H6.18 28.84,4.32 28.84,5.39 28.96,5.5 29.56,5.5 29.72,5.66 29.72,5.9 29.59,6.03 28.92,6.03 28.77,6.18 28.77,6.45 28.93,6.6 30.35,6.6 30.5,6.76 30.5,6.98 30.35,7.14 29.35,7.14 29.19,7.3 29.19,7.5 29.33,7.65 30.4,7.65 30.55,7.8 30.55,8.02 30.4,8.18 29.6,8.18 29.44,8.33 29.44,8.49 29.44,8.49 29.64,8.69 29.88,8.69 29.99,8.81 29.99,10.84 arc(30.05,10.98) 30.18,11.03 30.3,11.03 arc(30.49,11.22) 30.3,11.41 30.18,11.41 arc(29.99,11.6) 30.18,11.79 30.3,11.79 arc(30.49,11.98) 30.3,12.17 30.18,12.17 arc(29.99,12.36) 30.18,12.56 30.3,12.56 arc(30.49,12.75) 30.3,12.94 30.18,12.94 arc(29.99,13.13) 30.18,13.32 30.3,13.32 arc(30.49,13.51) 30.3,13.7 30.18,13.7 arc(29.99,13.89) 30.18,14.08 30.3,14.08 arc(30.49,14.27) 30.3,14.46 30.18,14.46 arc(29.99,14.65) 30.18,14.84 30.3,14.84 arc(30.49,15.03) 30.3,15.22 30.18,15.22 arc(29.99,15.41) 30.18,15.6 30.3,15.6 arc(30.49,15.79) 30.3,15.98 30.18,15.98 arc(29.99,16.17) 30.18,16.36 30.3,16.36 arc(30.49,16.56) 30.3,16.75 30.18,16.75 arc(30.05,16.8) 29.99,16.94 29.99,20.11 v1(29.6,20.5)
P0_TX_D10: length 28.4
  Bottom Layer w0.158: H6.20 32.42,5.26 32.42,5.51 arc(32.47,5.64) 32.61,5.7 33.16,5.7 arc(33.35,5.89) 33.16,6.08 32.61,6.08 arc(32.42,6.27) 32.61,6.46 33.16,6.46 arc(33.35,6.65) 33.16,6.84 32.61,6.84 arc(32.42,7.03) 32.61,7.22 33.16,7.22 arc(33.35,7.41) 33.16,7.6 32.61,7.6 arc(32.42,7.79) 32.61,7.98 33.16,7.98 arc(33.35,8.17) 33.16,8.37 32.61,8.37 arc(32.47,8.42) 32.42,8.56 32.42,10.38 arc(32.47,10.52) 32.61,10.57 32.68,10.57 arc(32.87,10.76) 32.68,10.95 32.61,10.95 arc(32.42,11.14) 32.61,11.33 32.68,11.33 arc(32.87,11.52) 32.68,11.71 32.61,11.71 arc(32.47,11.77) 32.42,11.91 32.42,16.83 31.59,17.66 31.59,21.52 31.4,21.71 29.19,21.71 v1(28.8,22.1)
P0_TX_D11: length 28.4
  Bottom Layer w0.158: v1(29.6,21.3) 29.63,21.3 30.02,20.91 30.63,20.91 30.8,20.74 30.8,17.38 31.16,17.02 31.16,14.05 arc(31.21,13.91) 31.35,13.86 31.47,13.86 arc(31.66,13.67) 31.47,13.47 31.35,13.47 arc(31.16,13.28) 31.35,13.09 31.47,13.09 arc(31.66,12.9) 31.47,12.71 31.35,12.71 arc(31.16,12.52) 31.35,12.33 31.47,12.33 arc(31.66,12.14) 31.47,11.95 31.35,11.95 arc(31.16,11.76) 31.35,11.57 31.47,11.57 arc(31.66,11.38) 31.47,11.19 31.35,11.19 arc(31.16,11) 31.35,10.81 31.47,10.81 arc(31.66,10.62) 31.47,10.43 31.35,10.43 arc(31.16,10.24) 31.35,10.05 31.47,10.05 arc(31.66,9.86) 31.47,9.67 31.35,9.67 arc(31.16,9.47) 31.35,9.28 31.47,9.28 arc(31.66,9.09) 31.47,8.9 31.35,8.9 arc(31.16,8.71) 31.35,8.52 31.47,8.52 arc(31.66,8.33) 31.47,8.14 31.35,8.14 arc(31.16,7.95) 31.35,7.76 31.47,7.76 arc(31.66,7.57) 31.47,7.38 31.35,7.38 arc(31.16,7.19) 31.35,7 31.47,7 arc(31.66,6.81) 31.47,6.62 31.35,6.62 arc(31.21,6.56) 31.16,6.43 31.16,6.18 30.22,5.25 30.22,3.13 31.43,1.92 H6.19
P1_RX_D0: length 29.8
  Top Layer w0.158: H5.13 16.21,43.27 17.53,41.95 17.53,38.88 arc(17.47,38.74) 17.34,38.69 17.28,38.69 arc(17.09,38.5) 17.28,38.31 17.34,38.31 arc(17.53,38.12) 17.34,37.93 17.28,37.93 arc(17.09,37.74) 17.28,37.55 17.34,37.55 arc(17.53,37.35) 17.34,37.16 17.28,37.16 arc(17.09,36.97) 17.28,36.78 17.34,36.78 arc(17.53,36.59) 17.34,36.4 17.28,36.4 arc(17.09,36.21) 17.28,36.02 17.34,36.02 arc(17.53,35.83) 17.34,35.64 17.28,35.64 arc(17.09,35.45) 17.28,35.26 17.34,35.26 arc(17.53,35.07) 17.34,34.88 17.28,34.88 arc(17.09,34.69) 17.28,34.5 17.34,34.5 arc(17.53,34.31) 17.34,34.12 17.28,34.12 arc(17.09,33.93) 17.28,33.73 17.34,33.73 arc(17.53,33.54) 17.34,33.35 17.28,33.35 arc(17.09,33.16) 17.28,32.97 17.34,32.97 arc(17.53,32.78) 17.34,32.59 17.28,32.59 arc(17.09,32.4) 17.28,32.21 17.34,32.21 arc(17.53,32.02) 17.34,31.83 17.28,31.83 arc(17.09,31.64) 17.28,31.45 17.34,31.45 arc(17.47,31.39) 17.53,31.26 17.53,30.65 22.48,25.7 26,25.7 U2.K11
P1_RX_D1: length 29.8
  Top Layer w0.158: H5.16 13.72,40.66 13.72,38.66 arc(13.66,38.53) 13.53,38.47 13.29,38.47 arc(13.1,38.28) 13.29,38.09 13.53,38.09 arc(13.72,37.9) 13.53,37.71 13.29,37.71 arc(13.1,37.52) 13.29,37.33 13.53,37.33 arc(13.72,37.14) 13.53,36.95 13.29,36.95 arc(13.1,36.76) 13.29,36.57 13.53,36.57 arc(13.72,36.38) 13.53,36.19 13.29,36.19 arc(13.1,35.99) 13.29,35.8 13.53,35.8 arc(13.72,35.61) 13.53,35.42 13.29,35.42 arc(13.1,35.23) 13.29,35.04 13.53,35.04 arc(13.72,34.85) 13.53,34.66 13.29,34.66 arc(13.1,34.47) 13.29,34.28 13.53,34.28 arc(13.66,34.22) 13.72,34.09 13.72,30.9 20.12,24.5 U2.J12
P1_RX_D2: length 29.8
  Top Layer w0.158: 27.18,25.27 26.8,25.65 26.8,26.33 26.63,26.5 22.95,26.5 18.41,31.03 18.41,32.2 arc(18.47,32.34) 18.61,32.39 18.89,32.39 arc(19.08,32.58) 18.89,32.77 18.61,32.77 arc(18.41,32.96) 18.61,33.15 18.89,33.15 arc(19.08,33.34) 18.89,33.53 18.61,33.53 arc(18.41,33.72) 18.61,33.92 18.89,33.92 arc(19.08,34.11) 18.89,34.3 18.61,34.3 arc(18.41,34.49) 18.61,34.68 18.89,34.68 arc(19.08,34.87) 18.89,35.06 18.61,35.06 arc(18.41,35.25) 18.61,35.44 18.89,35.44 arc(19.08,35.63) 18.89,35.82 18.61,35.82 arc(18.47,35.88) 18.41,36.01 18.41,36.53 19.76,37.88 19.76,42 18.73,43.03 H5.11
P1_RX_D3: length 29.8
  Top Layer w0.158: U2.J11 25.99,24.91 22.12,24.91 16.13,30.9 16.13,32.77 arc(16.07,32.9) 15.94,32.96 15.72,32.96 arc(15.53,33.15) 15.72,33.34 15.94,33.34 arc(16.13,33.53) 15.94,33.72 15.72,33.72 arc(15.53,33.91) 15.72,34.1 15.94,34.1 arc(16.13,34.29) 15.94,34.48 15.72,34.48 arc(15.53,34.67) 15.72,34.87 15.94,34.87 arc(16.13,35.06) 15.94,35.25 15.72,35.25 arc(15.53,35.44) 15.72,35.63 15.94,35.63 arc(16.13,35.82) 15.94,36.01 15.72,36.01 arc(15.53,36.2) 15.72,36.39 15.94,36.39 arc(16.13,36.58) 15.94,36.77 15.72,36.77 arc(15.53,36.96) 15.72,37.15 15.94,37.15 arc(16.13,37.34) 15.94,37.53 15.72,37.53 arc(15.53,37.72) 15.72,37.91 15.94,37.91 arc(16.13,38.1) 15.94,38.29 15.72,38.29 arc(15.53,38.48) 15.72,38.68 15.94,38.68 arc(16.07,38.73) 16.13,38.87 16.13,40.67 H5.14
P1_RX_D4: length 29.8
  Bottom Layer w0.158: v1(28,25.3) 27.6,25.69 27.6,27.37 arc(27.55,27.51) 27.41,27.56 ; H5.5 26.92,43.27 27.6,42.59 27.6,39.43 arc(27.55,39.3) 27.41,39.24 27.41,39.24 arc(27.22,39.05) 27.41,38.86 27.41,38.86 arc(27.6,38.67) 27.41,38.48 27.41,38.48 arc(27.22,38.29) 27.41,38.1 27.41,38.1 arc(27.6,37.91) 27.41,37.72 27.41,37.72 arc(27.22,37.53) 27.41,37.33 27.41,37.33 arc(27.6,37.14) 27.41,36.95 27.41,36.95 arc(27.22,36.76) 27.41,36.57 27.41,36.57 arc(27.6,36.38) 27.41,36.19 27.41,36.19 arc(27.22,36) 27.41,35.81 27.41,35.81 arc(27.55,35.76) 27.6,35.62 27.6,34.16 arc(27.66,34.03) 27.8,33.97 28.19,33.97 arc(28.38,33.78) 28.19,33.59 27.8,33.59 arc(27.6,33.4) 27.8,33.21 28.19,33.21 arc(28.38,33.02) 28.19,32.83 27.8,32.83 arc(27.6,32.64) 27.8,32.45 28.19,32.45 arc(28.38,32.26) 28.19,32.07 27.8,32.07 arc(27.6,31.88) 27.8,31.69 28.19,31.69 arc(28.38,31.5) 28.19,31.3 27.8,31.3 arc(27.66,31.25) 27.6,31.11 27.6,31.05 arc(27.55,30.91) 27.41,30.86 27,30.86 arc(26.81,30.67) 27,30.48 27.41,30.48 arc(27.55,30.42) 27.6,30.29 27.6,29.92 arc(27.55,29.79) 27.41,29.73 27.35,29.73 arc(27.16,29.54) 27.35,29.35 27.41,29.35 arc(27.55,29.3) 27.6,29.16 27.6,28.97 arc(27.55,28.84) 27.41,28.78 26.91,28.78 arc(26.72,28.59) 26.91,28.4 27.41,28.4 arc(27.55,28.35) 27.6,28.21 27.6,28.13 arc(27.55,28) 27.41,27.94 ; 27.41,27.56 arc(27.22,27.75) 27.41,27.94
P1_RX_D5: length 29.8
  Bottom Layer w0.158: H5.7 23.96,43.27 25.15,42.08 25.15,35.94 26.03,35.05 26.03,34.64 arc(25.98,34.5) 25.84,34.45 25.34,34.45 arc(25.15,34.25) 25.34,34.06 25.84,34.06 arc(26.03,33.87) 25.84,33.68 25.34,33.68 arc(25.15,33.49) 25.34,33.3 25.84,33.3 arc(26.03,33.11) 25.84,32.92 25.34,32.92 arc(25.15,32.73) 25.34,32.54 25.84,32.54 arc(26.03,32.35) 25.84,32.16 25.34,32.16 arc(25.15,31.97) 25.34,31.78 25.84,31.78 arc(25.98,31.72) 26.03,31.59 26.03,31.41 25.4,30.78 25.4,30.35 arc(25.34,30.22) 25.21,30.16 25.14,30.16 arc(24.95,29.97) 25.14,29.78 25.21,29.78 arc(25.4,29.59) 25.21,29.4 25.14,29.4 arc(24.95,29.21) 25.14,29.02 25.21,29.02 arc(25.34,28.96) 25.4,28.83 25.4,28.33 25.98,27.75 25.98,27.49 arc(25.93,27.36) 25.79,27.3 25.14,27.3 arc(24.95,27.11) 25.14,26.92 25.79,26.92 arc(25.93,26.87) 25.98,26.73 25.98,25.11 26.6,24.5 v1(27.2,24.5)
P1_RX_D6: length 29.8
  Bottom Layer w0.158: 28.39,26.43 28,26.82 28,27.13 arc(28.05,27.27) 28.19,27.32 28.66,27.32 arc(28.85,27.51) 28.66,27.7 28.19,27.7 arc(28,27.89) 28.19,28.08 28.66,28.08 arc(28.85,28.28) 28.66,28.47 28.19,28.47 arc(28,28.66) 28.19,28.85 28.66,28.85 arc(28.85,29.04) 28.66,29.23 28.19,29.23 arc(28,29.42) 28.19,29.61 28.66,29.61 arc(28.85,29.8) 28.66,29.99 28.19,29.99 arc(28.05,30.05) 28,30.18 28,30.49 28.74,31.23 28.74,32.9 arc(28.8,33.04) 28.93,33.09 29.12,33.09 arc(29.31,33.28) 29.12,33.47 28.93,33.47 arc(28.74,33.66) 28.93,33.85 29.12,33.85 arc(29.31,34.04) 29.12,34.23 28.93,34.23 arc(28.8,34.29) 28.74,34.42 28.74,34.92 arc(28.69,35.06) 28.55,35.11 28.36,35.11 arc(28.17,35.31) 28.36,35.5 28.55,35.5 arc(28.69,35.55) 28.74,35.69 28.74,36.43 arc(28.69,36.56) 28.55,36.62 28.2,36.62 arc(28.01,36.81) 28.2,37 28.55,37 arc(28.74,37.19) 28.55,37.38 28.2,37.38 arc(28.01,37.57) 28.2,37.76 28.55,37.76 arc(28.74,37.95) 28.55,38.14 28.2,38.14 arc(28.01,38.33) 28.2,38.52 28.55,38.52 arc(28.69,38.58) 28.74,38.71 28.74,38.83 28.62,38.95 28.08,38.95 27.95,39.08 27.95,39.24 28.07,39.37 28.73,39.37 28.98,39.12 29.13,39.12 29.28,39.27 29.28,39.47 28.89,39.86 H5.4 ; 28.4,26.43 28.4,25.71 v1(28.8,25.3)
P1_RX_D7: length 29.8
  Bottom Layer w0.158: H5.6 26.35,39.61 26.8,39.16 26.8,38.84 arc(26.74,38.71) 26.61,38.65 25.84,38.65 arc(25.65,38.46) 25.84,38.27 26.61,38.27 arc(26.8,38.08) 26.61,37.89 25.84,37.89 arc(25.65,37.7) 25.84,37.51 26.61,37.51 arc(26.74,37.45) 26.8,37.32 26.8,36.83 arc(26.74,36.69) 26.61,36.64 25.97,36.64 arc(25.78,36.45) 25.97,36.26 26.61,36.26 arc(26.8,36.07) 26.61,35.88 26.37,35.88 arc(26.17,35.69) 26.37,35.5 26.61,35.5 arc(26.74,35.44) 26.8,35.31 27.05,35.05 27.05,34.69 arc(27,34.55) 26.86,34.5 26.66,34.5 arc(26.47,34.31) 26.66,34.12 26.86,34.12 arc(27.05,33.93) 26.86,33.74 26.66,33.74 arc(26.47,33.55) 26.66,33.36 26.86,33.36 arc(27.05,33.17) 26.86,32.97 26.66,32.97 arc(26.47,32.78) 26.66,32.59 26.86,32.59 arc(27.05,32.4) 26.86,32.21 26.66,32.21 arc(26.47,32.02) 26.66,31.83 26.86,31.83 arc(27,31.78) 27.05,31.64 27.05,31.5 26.79,31.23 26.5,31.23 26.34,31.08 26.34,30.83 25.8,30.28 25.8,29.72 arc(25.85,29.58) 25.99,29.52 26.53,29.52 arc(26.72,29.33) 26.53,29.14 25.99,29.14 arc(25.85,29.09) 25.8,28.95 25.8,28.73 26.8,27.73 26.8,25.37 27.23,24.93 27.57,24.93 v1(28,24.5)
P1_RX_D8: length 29.8
  Bottom Layer w0.158: v1(29.6,25.3) 29.21,25.69 29.21,27.75 arc(29.24,27.83) 29.32,27.86 arc(29.4,27.9) 29.43,27.97 29.43,28.13 arc(29.4,28.21) 29.32,28.24 arc(29.24,28.28) 29.21,28.36 29.21,28.52 arc(29.24,28.59) 29.32,28.63 arc(29.4,28.66) 29.43,28.74 29.43,28.9 arc(29.4,28.97) 29.32,29.01 arc(29.24,29.04) 29.21,29.12 29.21,29.28 arc(29.24,29.36) 29.32,29.39 arc(29.4,29.42) 29.43,29.5 29.43,29.66 arc(29.4,29.74) 29.32,29.77 arc(29.24,29.8) 29.21,29.88 29.21,30.49 29.72,31 29.72,31.67 arc(29.66,31.81) 29.53,31.86 29.34,31.86 arc(29.15,32.05) 29.34,32.24 29.53,32.24 arc(29.66,32.3) 29.72,32.43 29.72,36.03 29.5,36.24 29.24,36.24 29.11,36.37 29.11,36.59 29.25,36.73 30.19,36.73 30.34,36.88 30.34,36.89 30.34,37.04 30.2,37.17 29.32,37.17 29.15,37.34 29.15,37.52 29.26,37.63 30.98,37.63 31.11,37.76 31.11,37.94 30.99,38.06 29.33,38.06 29.22,38.17 29.22,38.36 29.32,38.47 30.97,38.47 31.1,38.6 31.1,38.78 30.99,38.9 29.78,38.9 29.7,38.98 29.7,39.2 29.81,39.32 29.97,39.32 30.1,39.45 30.1,42.07 28.91,43.27 H5.3
P1_RX_D9: length 21.4
  Bottom Layer w0.158: H5.8 23.11,40.03 23.11,26.33 25.32,24.12 28.42,24.12 v1(28.8,24.5)
P1_RX_D10: length 29.8
  Bottom Layer w0.158: v1(29.6,24.5) 29.98,24.88 29.98,30.02 30.4,30.44 30.4,31.3 arc(30.45,31.43) 30.59,31.49 31.43,31.49 arc(31.62,31.68) 31.43,31.87 30.59,31.87 arc(30.4,32.06) 30.59,32.25 31.43,32.25 arc(31.62,32.44) 31.43,32.63 30.59,32.63 arc(30.4,32.82) 30.59,33.01 31.43,33.01 arc(31.62,33.2) 31.43,33.39 30.59,33.39 arc(30.4,33.58) 30.59,33.78 31.43,33.78 arc(31.62,33.97) 31.43,34.16 30.59,34.16 arc(30.4,34.35) 30.59,34.54 31.43,34.54 arc(31.62,34.73) 31.43,34.92 30.59,34.92 arc(30.4,35.11) 30.59,35.3 31.43,35.3 arc(31.62,35.49) 31.43,35.68 30.59,35.68 arc(30.45,35.74) 30.4,35.87 30.4,36.34 31.5,37.44 31.5,40.66 H5.2
P1_RX_D11: length 29.8
  Bottom Layer w0.158: v1(28.8,23.7) 28.38,23.28 25.27,23.28 22.61,25.95 22.61,26.71 arc(22.55,26.84) 22.42,26.9 22.08,26.9 arc(21.89,27.09) 22.08,27.28 22.42,27.28 arc(22.61,27.47) 22.42,27.66 22.08,27.66 arc(21.89,27.85) 22.08,28.04 22.42,28.04 arc(22.61,28.23) 22.42,28.42 22.08,28.42 arc(21.89,28.61) 22.08,28.8 22.42,28.8 arc(22.61,28.99) 22.42,29.18 22.08,29.18 arc(21.89,29.37) 22.08,29.56 22.42,29.56 arc(22.55,29.62) 22.61,29.75 22.61,41.95 21.29,43.27 H5.9
RESETB: length 37.8
  Inner2 w0.152: H8.12 1.74,36.77 3.01,35.5 6.34,35.5 14.22,27.62 30.46,27.62 30.82,27.27 30.82,25.68 v1(31.2,25.3)
  Bottom Layer w0.152: v1(31.2,25.3) 31.62,25.72 R21.1
RX1A_N: length 2.6
  Top Layer w0.158: C88.2 32.74,27.76 U2.M2
RX1A_P: length 2.6
  Top Layer w0.158: C89.2 35.27,27.77 U2.M1
RX2A_N: length 2.5
  Top Layer w0.158: U2.A1 35.24,17.26 C90.2
RX2A_P: length 2.5
  Top Layer w0.158: U2.A2 32.72,17.22 C91.2
RX_FRAME_N: length 29.8
  Bottom Layer w0.109: H5.12 19.79,40.73 19.87,40.65 19.87,38.51 arc(19.81,38.36) 19.67,38.3 19.41,38.3 arc(18.95,37.84) 19.41,37.37 19.67,37.37 arc(19.81,37.31) 19.87,37.17 19.87,25.65 22.35,23.17 24.35,23.17 25.24,22.28 25.24,21.91 25.46,21.7 28.19,21.7 ; v1(29.6,22.9) 29.21,22.51 29.2,22.52 28.59,22.52 28.38,22.31 28.38,21.9 28.19,21.7
RX_FRAME_P: length 29.8
  Bottom Layer w0.109: H5.10 20.21,40.73 20.13,40.65 20.13,38.51 arc(19.99,38.18) 19.67,38.04 19.41,38.04 arc(19.21,37.84) 19.41,37.64 19.67,37.64 arc(19.99,37.5) 20.13,37.17 20.13,33.24 arc(20.18,33.12) 20.3,33.07 arc(20.41,33.02) 20.46,32.91 20.46,32.85 arc(20.41,32.74) 20.3,32.69 arc(20.18,32.64) 20.13,32.53 20.13,32.47 arc(20.18,32.36) 20.3,32.31 arc(20.41,32.26) 20.46,32.14 20.46,32.09 arc(20.41,31.98) 20.3,31.93 arc(20.18,31.88) 20.13,31.76 20.13,31.71 arc(20.18,31.6) 20.3,31.55 arc(20.41,31.5) 20.46,31.38 20.46,31.33 arc(20.41,31.21) 20.3,31.17 arc(20.18,31.12) 20.13,31 20.13,30.95 arc(20.18,30.83) 20.3,30.78 arc(20.41,30.74) 20.46,30.62 20.46,30.57 arc(20.41,30.45) 20.3,30.4 arc(20.18,30.36) 20.13,30.24 20.13,30.19 arc(20.18,30.07) 20.3,30.02 arc(20.41,29.97) 20.46,29.86 20.46,29.81 arc(20.41,29.69) 20.3,29.64 arc(20.18,29.59) 20.13,29.48 20.13,29.43 arc(20.18,29.31) 20.3,29.26 arc(20.41,29.21) 20.46,29.1 20.46,29.04 arc(20.41,28.93) 20.3,28.88 arc(20.18,28.83) 20.13,28.72 20.13,25.76 22.46,23.43 24.46,23.43 25.37,22.52 28.22,22.52 28.61,22.9 28.8,22.9 v1(28.8,22.9)
SPI_CLK: length 29.9
  Inner2 w0.158: H8.7 5.18,31.69 11.96,24.91 30.79,24.91 v1(31.2,24.5)
SPI_DI: length 34.4
  Inner2 w0.158: v1(32,24.5) 31.58,24.92 31.58,27.64 30.92,28.31 15.34,28.31 6.9,36.75 4.29,36.75 H8.11
SPI_DO: length 29.5
  Inner2 w0.158: v1(30.4,26.1) 30.01,26.49 13.56,26.49 5.84,34.2 4.29,34.2 H8.9
SPI_ENB: length 32.4
  Inner2 w0.158: v1(30.4,25.3) 29.98,25.72 12.8,25.72 5.59,32.94 3.05,32.94 1.75,34.23 H8.10
TX1A_N: length 3.9
  Top Layer w0.158: L15.2 27.83,29.02 C93.1 27.95,27.75 U2.M8
TX1A_P: length 3.8
  Top Layer w0.158: U2.M7 30.5,27.8 C92.1 30.58,29.07 L14.2
TX2A_N: length 3.7
  Top Layer w0.152: C97.1 30.55,15.84 L18.2
  Top Layer w0.158: C97.1 30.49,17.21 U2.A7
TX2A_P: length 3.9
  Top Layer w0.152: C96.1 26.73,15.9 L17.2
  Top Layer w0.158: U2.A8 27.94,17.24 C96.1
TX_FRAME_N: length 28.4
  Top Layer w0.109: v1(28,23.7) 28.38,23.32 28.38,19.44 28.19,19.26 27.8,19.26 27.61,19.07 27.61,17.89 26.35,16.62 arc(26.02,16.49) 25.69,16.62 25.06,17.25 arc(24.77,17.25) 24.77,16.97 25.41,16.34 arc(25.4,15.68) 24.75,15.68 24.12,16.31 arc(23.83,16.31) 23.83,16.02 24.46,15.39 arc(24.6,15.06) 24.46,14.73 22.67,12.94 22.67,4.35 22.75,4.27 H6.14
TX_FRAME_P: length 28.4
  Top Layer w0.109: H6.12 22.33,4.27 22.41,4.35 22.41,10.37 arc(22.36,10.48) 22.25,10.52 arc(22.15,10.57) 22.1,10.68 22.1,10.75 arc(22.14,10.86) 22.25,10.9 arc(22.36,10.95) 22.41,11.06 22.41,11.13 arc(22.36,11.24) 22.25,11.28 arc(22.15,11.33) 22.1,11.44 22.1,11.51 arc(22.14,11.62) 22.25,11.66 arc(22.36,11.71) 22.41,11.82 22.41,11.89 arc(22.36,12) 22.25,12.05 arc(22.15,12.09) 22.1,12.2 22.1,12.27 arc(22.14,12.38) 22.25,12.43 arc(22.36,12.47) 22.41,12.58 22.41,13.05 24.28,14.92 arc(24.33,15.06) 24.28,15.21 23.64,15.84 arc(23.64,16.49) 24.3,16.49 24.93,15.86 arc(25.22,15.86) 25.22,16.15 24.59,16.78 arc(24.59,17.44) 25.25,17.44 25.88,16.81 arc(26.02,16.75) 26.16,16.81 26.81,17.46 26.81,19.06 27.05,19.29 27.36,19.29 27.56,19.49 27.56,22.46 v1(28,22.9)
TX_VCO_1V1: length 5.2
  Top Layer w0.254: v1(26.4,18.9) U2.A11
  Bottom Layer w0.254: C38.1 23.76,16.35 R19.2 26.4,17.73 v1(26.4,18.9)
TXNRX: length 33.6
  Inner2 w0.158: H8.8 1.73,31.59 2.92,30.39 5.33,30.39 11.42,24.31 19.2,24.31 19.4,24.1 31.6,24.1 v1(32,23.7)
XTALN: length 7.7
  Top Layer w0.152: C56.1 21.3,31.41 21.97,31.41 22.29,31.09 22.29,30.17 C152.2 22.26,28.71 23.5,27.47 25.03,27.47 U2.M12
$1N2875: length 1.4
  Bottom Layer w0.254: R19.1 C37.2
$1N2947: length 1.4
  Bottom Layer w0.254: R20.1 C39.2
$1N2949: length 4.5
  Top Layer w0.254: U2.G3 v1(33.6,22.9)
  Bottom Layer w0.254: C40.1 36.02,21.65 R20.2 36.01,22.9 v1(33.6,22.9)
$1N3010: length 2
  Bottom Layer w0.152: v1(32,26.1) 32.38,26.48 32.38,27.42 R22.1
$1N3030: length 3.5
  Top Layer w0.254: L10.1 C55.1 23.6,34.37 OSC1.4
$1N3034: length 1.8
  Top Layer w0.152: OSC1.3 21.21,34.18 C56.2
$3N1695: length 14.6
  Top Layer w0.158: RF2.5 arc(44.9,34.26) 42.57,34.31 arc(40.67,34.78) 39.12,35.98 arc(37.92,36.94) 36.45,37.38 arc(35.7,37.16) 35.31,36.49 arc(35.29,35.86) L11.3
$3N1696: length 1.8
  Top Layer w0.158: L11.6 32.74,30.21 C88.1
$3N1697: length 1.8
  Top Layer w0.158: C89.1 35.28,30.25 L11.4
$3N1706: length 17.5
  Top Layer w0.158: RF3.5 43.28,10.68 arc(42.94,10.66) 42.61,10.59 arc(42.3,10.44) 42.09,10.17 arc(40.62,8.51) 38.54,7.74 arc(35.91,7.58) 33.27,7.66 arc(32.93,7.82) 32.77,8.17 arc(32.72,8.94) L12.3
$3N1707: length 1.9
  Top Layer w0.158: 35.25,12.89 35.25,14.83 C90.1
$3N1708: length 1.9
  Top Layer w0.158: C91.1 32.72,12.9 32.71,12.89
$3N1714: length 14.4
  Top Layer w0.158: L13.3 arc(30.52,35.87) 30.55,36.51 arc(30.78,37.22) 31.31,37.75 arc(31.84,38) 32.42,38.14 arc(33.74,38.25) 35.06,38.29 arc(36.94,38.34) 38.8,38.46 arc(39.13,38.59) 39.34,38.88 arc(39.37,39) 39.39,39.11 arc(39.39,40.65) RF4.5
$3N1722: length 1.8
  Top Layer w0.158: C92.2 30.5,32.04 L13.4
$3N1723: length 1.8
  Top Layer w0.158: C93.2 27.95,32.04 L13.6
$3N1727: length 16.7
  Top Layer w0.158: L16.3 arc(27.97,8.86) 28.07,8.04 arc(28.15,7.82) 28.32,7.66 arc(28.75,7.44) 29.21,7.28 arc(30.53,6.98) 31.88,6.77 34.16,6.52 arc(36.32,6.37) 38.48,6.39 arc(39.04,6.23) 39.37,5.76 arc(39.39,5.64) 39.4,5.52 arc(39.34,4.12) RF5.5
$3N1735: length 1.9
  Top Layer w0.158: C96.2 27.94,12.87
$3N1736: length 1.9
  Top Layer w0.158: L16.6 30.49,12.87 30.49,14.81

## Copper pours and planes (outline as drawn; the poured copper is in the pictures)
GND on Top Layer: -1.52,46.4 26.92,46.4 26.92,-1.86 -1.52,-1.86
GND on Bottom Layer: -1.4,46.14 51.94,46.14 51.94,-1.61 -1.4,-1.61
GND on Inner1: 0.26,44.74 49.74,44.74 49.74,0.26 0.26,0.26
GND on Inner2: -0.25,44.62 52.07,44.62 52.07,-1.61 -0.25,-1.61

Small or netless copper shapes (teardrops, artwork), in the pictures only: 49 on Inner1

## Text on the board
Bottom Silkscreen Layer: GND | DCKP | FCKN | DCKN | D1 | FCKP | D2 | D0 | D3 | FRN | D4 | D11 | FRP | D5 | D6 | D9 | D8 | D7 | D10 | CKOUT | RX | TX | Port
Top Silkscreen Layer: AGC | GND | TNR | SEN | RST | IN2 | 1V3_B | 1V3_A | 3V3 | 1V8 | OUT2 | SCK | SDO | CLK | SDI | EN | By ConstString | ADC0 | DAC1 | DAC0 | G | RX2 | RX1 | TX2 | TX1 | AD9363 | Debug.V | 等长1172mil | 等长1117mil
